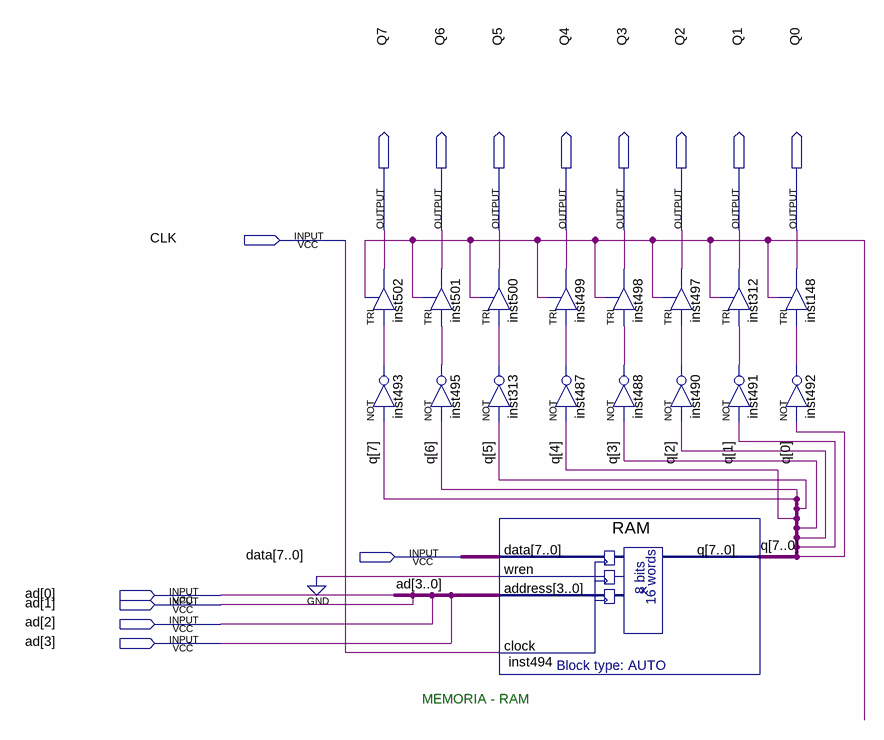
[diagram p0: schematic sheet]
// Quartus schematic MEMORIA_RAM.bdf as structural Verilog: 17 symbols, 14 pins
module MEMORIA_RAM (
  input  CLK,
  input  [7:0] data,
  input  [3:0] ad,
  output Q7,
  output Q6,
  output Q5,
  output Q4,
  output Q3,
  output Q2,
  output Q1,
  output Q0
);

  wire inst313_out, inst487_out, inst488_out, inst490_out, inst491_out, inst492_out, inst493_out,
       inst495_out, undriven;

  TRI inst502 (.IN(inst493_out), .OE(undriven), .OUT(Q7));
  not inst493 (inst493_out, Q7);
  TRI inst501 (.IN(inst495_out), .OE(undriven), .OUT(Q6));
  not inst495 (inst495_out, Q6);
  TRI inst500 (.IN(inst313_out), .OE(undriven), .OUT(Q5));
  not inst313 (inst313_out, Q5);
  RAM inst494 (.data(data), .wren(1'b0), .address(ad), .clock(CLK), .q({Q7, Q6, Q5, Q4, Q3, Q2, Q1, Q0}));
  TRI inst498 (.IN(inst488_out), .OE(undriven), .OUT(Q3));
  TRI inst499 (.IN(inst487_out), .OE(undriven), .OUT(Q4));
  not inst487 (inst487_out, Q4);
  not inst488 (inst488_out, Q3);
  TRI inst497 (.IN(inst490_out), .OE(undriven), .OUT(Q2));
  not inst490 (inst490_out, Q2);
  TRI inst312 (.IN(inst491_out), .OE(undriven), .OUT(Q1));
  not inst491 (inst491_out, Q1);
  TRI inst148 (.IN(inst492_out), .OE(undriven), .OUT(Q0));
  not inst492 (inst492_out, Q0);

  // Notes on the sheet:
  //   MEMORIA - RAM
endmodule
